# EAGLE design Top board (EAGLE 7.1.0)
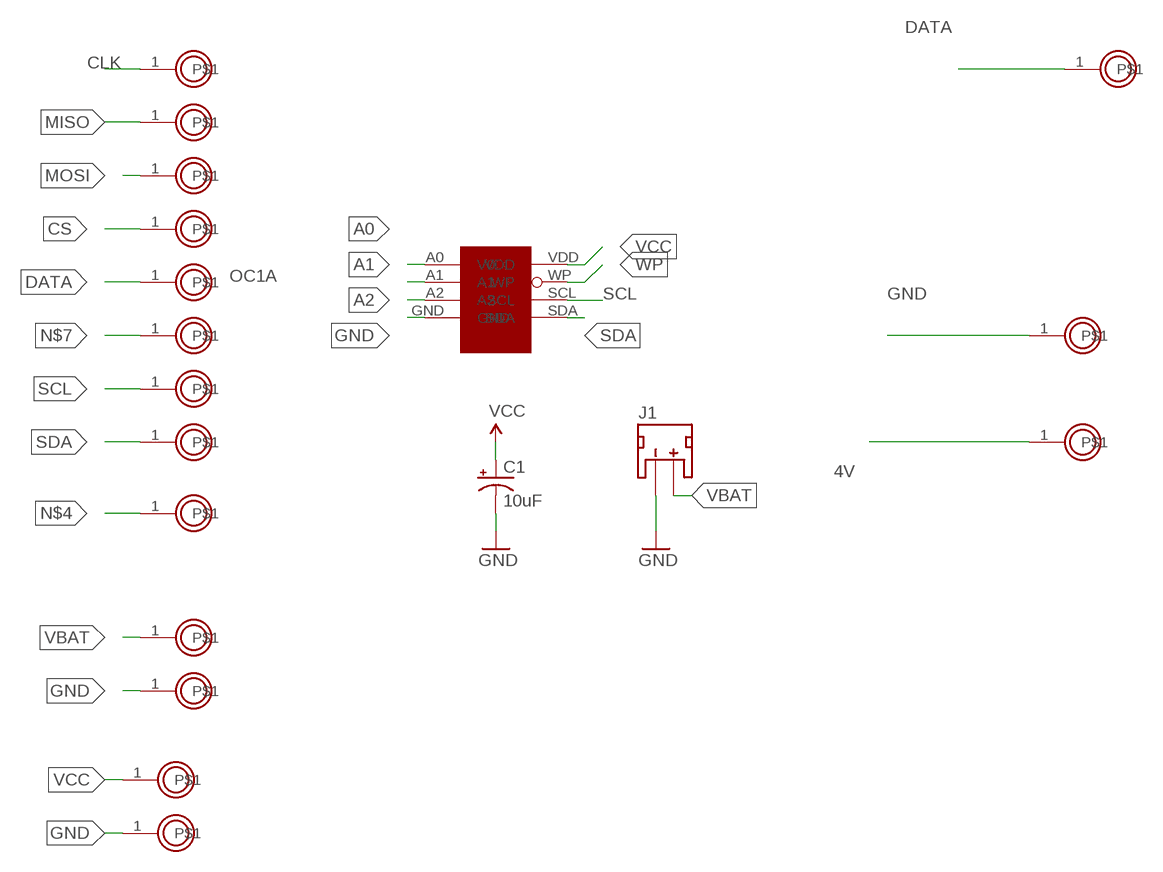
[diagram p0: schematic, sheet 1]

## Parts
0  PROTO_POINT  [1X01]
1  PROTO_POINT  [1X01]
2  PROTO_POINT  [1X01]
3  PROTO_POINT  [1X01]
4  PROTO_POINT  [1X01]
4V  PROTO_POINT  [1X01]
5  PROTO_POINT  [1X01]
A0  PROTO_POINT  [1X01]
A1  PROTO_POINT  [1X01]
BAT  PROTO_POINT  [1X01]
C1  10uF  10UF-16V-10%(TANT)  [EIA3216]
DATA  PROTO_POINT  [1X01]
FRAM  MB85RC256V  MB85RC256VMB85RC256V  [SO08]
GND@1  PROTO_POINT  [1X01]
GND@2  PROTO_POINT  [1X01]
GND@3  PROTO_POINT  [1X01]
J1  JST_2MM_MALE  [JST-2-SMD]
RESET  PROTO_POINT  [1X01]
VCC  PROTO_POINT  [1X01]

## Nets
4V: 4V.1
A0: FRAM.A0(V0)
A1: FRAM.A1
A2: FRAM.A2
CLK: 5.1
CS: 2.1
DATA: 1.1 DATA.1
GND: C1.C(-) FRAM.GND GND@1.1 GND@2.1 GND@3.1 J1.1(-)
MISO: 4.1
MOSI: 3.1
N$4: RESET.1
N$7: 0.1
SCL: A1.1 FRAM.SCL
SDA: A0.1 FRAM.SDA
VBAT: BAT.1 J1.2(+)
VCC: C1.A(+) FRAM.VDD VCC.1
WP: FRAM.WP
Unconnected: J1.NC1(PAD1) J1.NC2(PAD2)

## Notes on the sheet
- OC1A

## Library data of the parts
0 1-4 4V 5 A0 A1 BAT DATA GND@1-GND@3 RESET VCC = BLEduino Bean:PROTO_POINT
C1 = SparkFun-Capacitors:10UF-16V-10%(TANT): CAP-00811 1206/EIA-3216 Tantalum capacitor; PROD_ID: CAP-00811
FRAM = radiationbean:MB85RC256V
J1 = SparkFun-Connectors:JST_2MM_MALE: Mates to single-cell LiPo batteries. CONN-08352; PROD_ID: CONN-08352

## Board
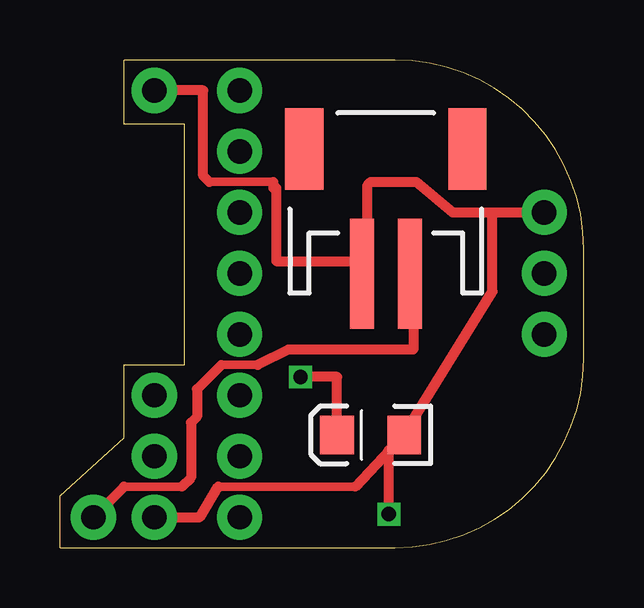
[diagram p1: board, top side]
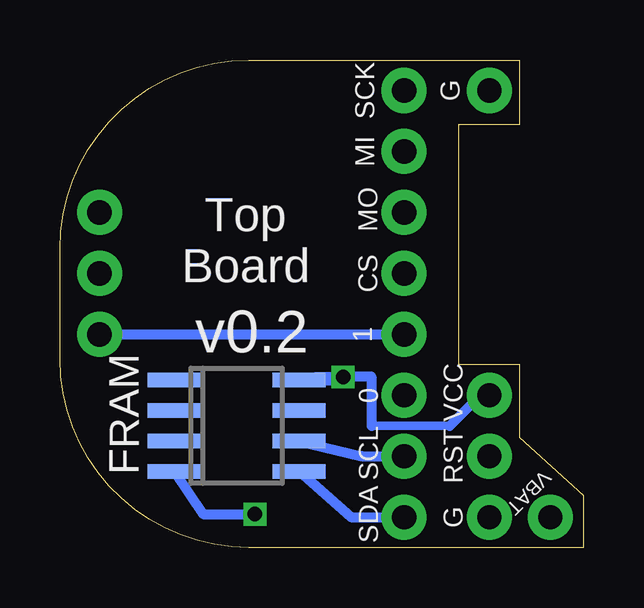
[diagram p2: board, bottom side, seen from below]

Size 21.84 x 20.32 mm. Coordinates in mm from the lower left corner, seen from the top.
Outline: 0,0 13.97,0 arc90 21.84,7.87 21.84,12.45 arc90 13.97,20.32 2.67,20.32 2.67,17.65 5.21,17.65 5.21,7.62 2.67,7.62 2.67,4.57 0,2.16 0,0
Copper layers (1*16): Top 0.0356mm / dielectric 1.5011mm / Bottom 0.0356mm
Design rules "oshPark": minimum track width 6mil, minimum drill 13mil, track to track 6mil, track to pad 6mil, pad to pad 6mil, via to via 6mil, smd to smd 6mil, copper to edge 15mil, drill to drill 6mil, minimum pad ring 7mil, minimum via ring 7mil, stop-mask expansion 3mil, vias tented up to drill 0mil, thermal gap 10mil

### Footprints (pad centres in the part's own frame; a part is rotated, then mirrored left to right if it is on the bottom)
1X01 = drill 1.016 pad 1.88: 1 0,0
EIA3216 = smd 1.4 x 1.6: A 1.4,0; C -1.4,0
SO08 = smd 0.6 x 2.2: A0 -1.905,-2.6; A1 -0.635,-2.6; A2 0.635,-2.6; GND 1.905,-2.6; SCL 0.635,2.6; SDA 1.905,2.6; VDD -1.905,2.6; WP -0.635,2.6
JST-2-SMD = smd 1 x 4.6: 1 -1,-3.7; 2 1,-3.7 | smd 1.6 x 3.4: NC1 -3.4,1.5; NC2 3.4,1.5

### Placement (x,y rotation side)
0  7.49,6.35 0 top
1  7.49,8.89 0 top
2  7.49,11.43 0 top
3  7.49,13.97 0 top
4  7.49,16.51 0 top
4V  20.19,11.43 0 top
5  7.49,19.05 0 top
A0  7.49,1.27 0 top
A1  7.49,3.81 0 top
BAT  1.4,1.27 0 top
C1  12.95,4.7 180 top
DATA  20.19,8.89 0 top
FRAM  14.48,5.08 270 bottom
GND@1  20.19,13.97 0 top
GND@2  3.94,1.27 0 top
GND@3  3.94,19.05 0 top
J1  13.59,15.11 0 top
RESET  3.94,3.81 0 top
VCC  3.94,6.35 0 top

### Tracks (layer width: path | path; a pad name or v marks a point on that pad's centre or on a via)
DATA
  Bottom 0.406: DATA.1 1.1
GND  (via drill 0.6)
  Top 0.356: 6.6,2.54 12.32,2.54 | 6.22,15.24 8.89,15.24
  Top 0.406: C1.C 18.03,10.66 18.03,13.97 | 18.03,13.97 GND@1.1 | 6.22,15.24 5.97,15.49 5.97,19.05 GND@3.1 | J1.1 12.7,12.26 | 12.7,12.26 12.83,13.3 12.83,15.11 12.95,15.24 14.86,15.24 16.38,13.97 18.03,13.97 | GND@2.1 5.84,1.27 6.6,2.54 | 12.32,2.54 C1.C | 8.89,15.24 8.89,14.99 9.02,14.99 9.02,11.94 12.7,11.94 12.7,12.26 | v13.72,1.4 13.72,4.06 C1.C
  Bottom 0.406: FRAM.GND 15.88,1.4 v13.72,1.4
  cutout Top (isolate 0.305): 13.97,20.32 arc-90 21.84,12.45 21.84,7.87 arc-90 13.97,0 0,0 0,2.16 2.67,4.57 2.67,7.62 5.21,7.62 5.21,17.65 2.67,17.65 2.67,20.32
  cutout Bottom: 2.67,17.65 2.67,20.32 13.97,20.32 arc-90 21.84,12.45 21.84,7.87 arc-90 13.97,0 0,0 0,2.16 2.67,4.57 2.67,7.62 5.21,7.62 5.21,17.65
SCL
  Bottom 0.406: FRAM.SCL 9.27,3.81 A1.1
SDA
  Bottom 0.406: FRAM.SDA 9.72,1.27 A0.1
VBAT
  Top 0.356: 8.25,7.62 6.73,7.62 | 5.08,2.54 2.67,2.54
  Top 0.406: J1.2 14.72,10.27 14.73,8.26 9.52,8.26 8.25,7.62 | 6.73,7.62 5.71,6.6 5.71,5.46 5.46,5.21 5.46,2.92 5.08,2.54 | 2.67,2.54 BAT.1
VCC  (via drill 0.6)
  Top 0.406: C1.A 11.55,7.11 v10.03,7.11
  Bottom 0.356: 8.85,5.08 5.59,5.08
  Bottom 0.406: v10.03,7.11 8.87,7.13 8.85,5.08 | 5.59,5.08 4.32,6.35 VCC.1 | 10.16,7.11 v10.03,7.11 | 11.17,7.11 10.16,7.11 | 10.16,7.11 10.03,6.99 | FRAM.VDD 10.16,6.99 v10.03,7.11

### Text on the board
bNames: G | SCK | MI | MO | Top / Board | CS | 1 | v0.2 | VCC | 0 | RST | SCL | VBAT | G | SDA
bValues: VBAT
Document: Bean Revision E | ray@ | P/N: PTD1013012E | punchthrough.com | ck@ | Rev E | Top Silk: tPlace tArt | Bottom Silk: bArt | Layers: 2 | Rectangular Dimensions: 1.775" x 0.8" (45.09mm x 20.32mm) | Finished Thickness: 0.062" | Finish: ENIG | Material: FR4 | Copper Weight: 1oz | Soldermask: Top and bottom | Silkscreen: Top and Bottom | Silkscreen Color: Black | Soldermask Color: 85% white 10% green 5% blue | Min Drill: 0.008" | Min Annular Ring: 0.006" | Min Trace: 0.007" | Min Spacing: 0.005" | Corner mill radius: 0.32" | Avoid placing copper in antenna keepout